# Altium project Luna v2.PrjPcb (part 7 of 7)
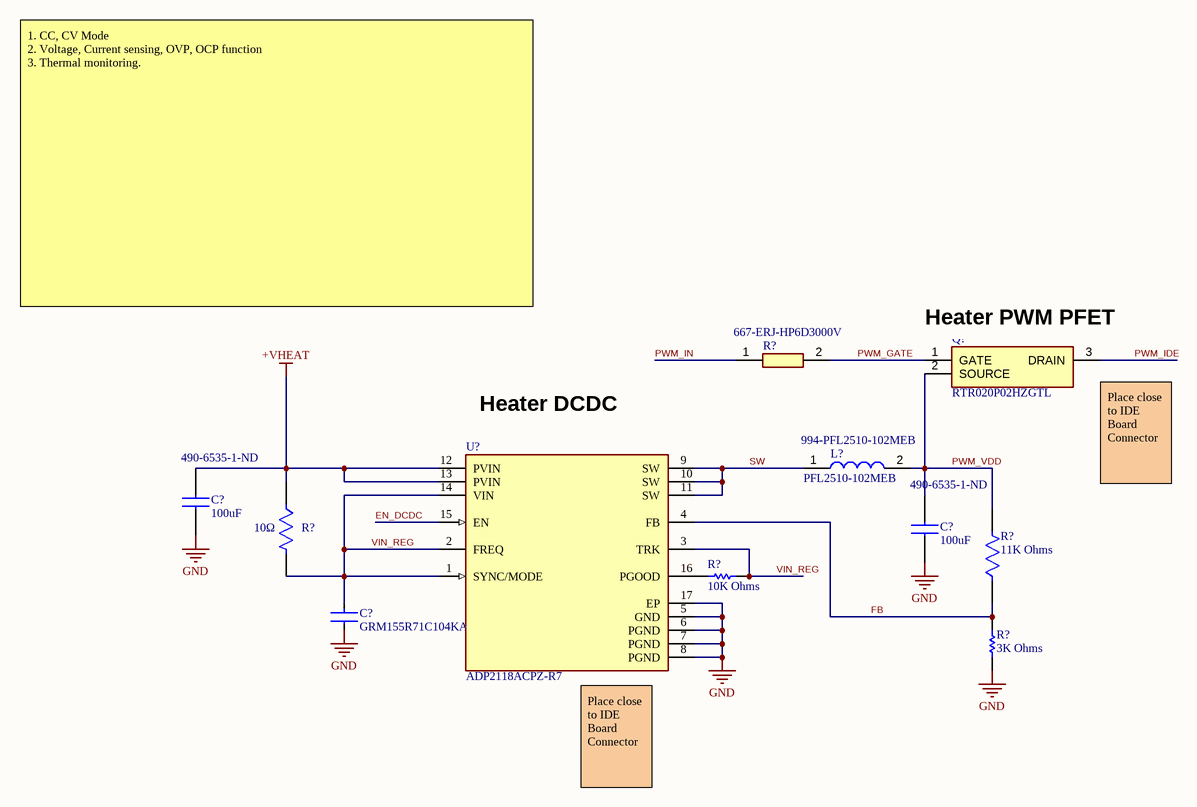
[diagram p28: Heater.SchDoc]

## Nets that join several sheets
+3.3V: Analog Sense (FB?#1.2 FB?#2.2), POWER (C?#19.1 C?#20.2 C?#21.2 U?#4.3)
+VHEAT: POWER (J?#2.6 J?#2.7), Heater (C?#22.1 R?#17.1 U?#5.12 U?#5.13)
DCDC_1V8_OUT: 04 MAIN POWER (R7.2), 05 MIMXRT1170 PART1 (C279.1 FB2.1 R416.2 U5.M6), 06 MIMXRT1170 PART2 (R23.2 R24.2 R373.2 R374.2), 08 B2B (C19.1 C22.1 J6.10), 15 BOOT (13 pins)
DCDC_1V8_OUT_SENSE: 05 MIMXRT1170 PART1 (7 pins), 08 B2B (J6.12)
GND: Analog Sense (36 pins), 04 MAIN POWER (32 pins), 05 MIMXRT1170 PART1 (87 pins), 06 MIMXRT1170 PART2 (17 pins), 07 MIMXRT1170 PART3 (11 pins), 08 B2B (58 pins), 09 Parallel Camera (15 pins), 10 FLASH_BOOT (C81.2 C82.2 U17.4), 11 SDRAM (17 pins), 12 DMIC (7 pins), 13 USB (11 pins), 14 TPU (115 pins), 15 BOOT (16 pins), 16 INTERFACE (15 pins), POWER (9 pins), Heater (9 pins)
MCM_1V8: 06 MIMXRT1170 PART2 (U10.3 U10.7), 07 MIMXRT1170 PART3 (U5.P2), 14 TPU (7 pins)
MCM_3V3: 07 MIMXRT1170 PART3 (C251.1 U5.D16), 08 B2B (J6.6), 14 TPU (29 pins), 16 INTERFACE (R171.2)
MCM_3V3_SENSE: 08 B2B (J6.8), 14 TPU (R22.1 U21.4)
VDD_1V8: 04 MAIN POWER (C23.1 C24.1 C25.1 R3.2), 06 MIMXRT1170 PART2 (26 pins), 07 MIMXRT1170 PART3 (11 pins), 08 B2B (6 pins), 10 FLASH_BOOT (R71.2), 11 SDRAM (FB6.1), 13 USB (U4.1), 16 INTERFACE (5 pins)
VDD_1V8_AON: 04 MAIN POWER (5 pins), 08 B2B (J6.3), 16 INTERFACE (R166.2)
VDD_1V8_CAM: 04 MAIN POWER (C14.1 TP7.1 U1.9), 06 MIMXRT1170 PART2 (U13.3 U13.7), 08 B2B (J6.2), 09 Parallel Camera (C31.1 C79.1 J7.11), 16 INTERFACE (C37.1 R13.2 U3.6)
VDD_1V8_MIC: 04 MAIN POWER (C15.1 TP26.1 U1.11), 08 B2B (J6.4), 12 DMIC (C20.1 C83.1 U19.4)
VDD_1V8_SENSE: 04 MAIN POWER (6 pins), 08 B2B (J6.47)
VDD_2V8_CAM: 04 MAIN POWER (C13.1 TP2.1 U1.2), 08 B2B (J6.1), 09 Parallel Camera (C27.1 C29.1 J7.2), 16 INTERFACE (R168.2)
VDD_3V3: Analog Sense (7 pins), 04 MAIN POWER (6 pins), 05 MIMXRT1170 PART1 (5 pins), 07 MIMXRT1170 PART3 (FB5.1), 08 B2B (5 pins), 14 TPU (U21.1), 16 INTERFACE (J10.3 R169.2 R170.2)
VDD_3V3_SENSE: 04 MAIN POWER (6 pins), 08 B2B (J6.31)
VDD_COIN_3V: 05 MIMXRT1170 PART1 (D3.A), 08 B2B (J5.83), 16 INTERFACE (J10.4)
VDD_LPSR_IN: 05 MIMXRT1170 PART1 (C300.1 R415.2 TP15.1 U5.R12), 08 B2B (J6.13)
VDD_SNVS_ANA: 05 MIMXRT1170 PART1 (6 pins), 16 INTERFACE (R167.2)
VDDA_1P0: 05 MIMXRT1170 PART1 (C276.1 U5.N11), 07 MIMXRT1170 PART3 (R1848.1), 08 B2B (J6.5)
VSYS: 04 MAIN POWER (9 pins), 05 MIMXRT1170 PART1 (C18.1 U2.3 U2.4), 06 MIMXRT1170 PART2 (R40.2), 08 B2B (7 pins), 16 INTERFACE (J9.12)
VUSB: 04 MAIN POWER (R8.2), 07 MIMXRT1170 PART3 (C252.1 U5.D17), 13 USB (8 pins)
ADC1_CH0A: 06 MIMXRT1170 PART2 (U5.N13), 16 INTERFACE (J9.3)
ADC1_CH0B: 06 MIMXRT1170 PART2 (U5.T17), 16 INTERFACE (J9.4)
BOOT_MODE0: 06 MIMXRT1170 PART2 (U5.P6), 15 BOOT (R163.2 SW1.5), 16 INTERFACE (R30.1 R31.2)
BOOT_MODE1: 06 MIMXRT1170 PART2 (U5.T7), 15 BOOT (R164.2 SW1.2), 16 INTERFACE (D6.A Q4.1 R29.1)
BRD_STAT_LED: 05 MIMXRT1170 PART1 (U5.L9), 16 INTERFACE (Q10.1 R172.1)
BT_CFG1_0_ENET_RGMII_TXD3: 06 MIMXRT1170 PART2 (R10.2 U5.D10), 15 BOOT (R139.1 R151.1)
BT_CFG1_1_ENET_RGMII_TXD2: 06 MIMXRT1170 PART2 (R16.2 U5.E12), 15 BOOT (R140.1 R152.1)
BT_CFG1_2_ENET_RGMII_TXD1: 06 MIMXRT1170 PART2 (R18.2 U5.A15), 15 BOOT (R141.1 R153.1)
BT_CFG1_3_ENET_RGMII_TXD0: 06 MIMXRT1170 PART2 (R19.2 U5.C13), 15 BOOT (R142.1 R154.1)
BT_CFG1_4_ENET_RGMII_TX_EN: 06 MIMXRT1170 PART2 (R20.2 U5.B14), 15 BOOT (R143.1 R155.1)
BT_CFG1_5_ENET_RGMII_TXC: 06 MIMXRT1170 PART2 (R26.2 U5.A14), 15 BOOT (R144.1 R156.1)
BT_CFG1_6: 06 MIMXRT1170 PART2 (U5.E8), 15 BOOT (R145.1 R157.1)
BT_CFG1_7: 06 MIMXRT1170 PART2 (U5.F8), 15 BOOT (R146.1 R158.1)
BT_CFG2_0: 06 MIMXRT1170 PART2 (U5.E9), 15 BOOT (R147.1 R159.1)
BT_CFG2_1: 06 MIMXRT1170 PART2 (U5.D7), 15 BOOT (R148.1 R160.1)
BT_CFG2_2: 06 MIMXRT1170 PART2 (U5.C7), 15 BOOT (R149.1 R161.1)
BT_CFG2_3: 06 MIMXRT1170 PART2 (U5.C9), 15 BOOT (R150.1 R162.1)
CA_AFE_MUX_EN: Analog Sense (U?#1.2), 06 MIMXRT1170 PART2 (R24.1 U5.E15)
CA_AFE_MUX_SEL0: Analog Sense (U?#1.1), 06 MIMXRT1170 PART2 (U5.J15)
CA_AFE_MUX_SEL1: Analog Sense (U?#1.16), 06 MIMXRT1170 PART2 (U5.J14)
CA_AFE_MUX_SEL2: Analog Sense (U?#1.15), 06 MIMXRT1170 PART2 (U5.H13)
CAMERA_TRIG: 07 MIMXRT1170 PART3 (U5.T2), 09 Parallel Camera (J7.4)
CSI_DATA02: 06 MIMXRT1170 PART2 (U5.J12), 09 Parallel Camera (J7.17)
CSI_DATA03: 06 MIMXRT1170 PART2 (U5.K12), 09 Parallel Camera (J7.18)
CSI_DATA04: 06 MIMXRT1170 PART2 (U5.K14), 09 Parallel Camera (J7.19)
CSI_DATA05: 06 MIMXRT1170 PART2 (U5.K13), 09 Parallel Camera (J7.20)
CSI_DATA06: 06 MIMXRT1170 PART2 (U5.L16), 09 Parallel Camera (J7.21)
CSI_DATA07: 06 MIMXRT1170 PART2 (U5.M16), 09 Parallel Camera (J7.22)
CSI_DATA08: 06 MIMXRT1170 PART2 (U5.N15), 09 Parallel Camera (J7.23)
CSI_DATA09: 06 MIMXRT1170 PART2 (U5.N17), 09 Parallel Camera (J7.24)
CSI_HSYNC: 06 MIMXRT1170 PART2 (U5.M14), 09 Parallel Camera (J7.6)
CSI_MCLK: 06 MIMXRT1170 PART2 (R44.2), 09 Parallel Camera (J7.14)
CSI_PIXCLK: 06 MIMXRT1170 PART2 (U5.P17), 09 Parallel Camera (J7.16)
CSI_VSYNC: 06 MIMXRT1170 PART2 (U5.N14), 09 Parallel Camera (J7.5), 16 INTERFACE (U3.2)
DA_GPIO0_WDOG_KICK: 04 MAIN POWER (TP27.1 U1.21), 05 MIMXRT1170 PART1 (U5.P10)
DA_nONKEY: 04 MAIN POWER (U1.15), 16 INTERFACE (5 pins)
DAC_OUT: 05 MIMXRT1170 PART1 (D31.K U5.H16), 16 INTERFACE (J10.9)
DMIC_DATA0: 06 MIMXRT1170 PART2 (U5.R6), 12 DMIC (R87.2)
FLEXPWM1_PWM0_A: 06 MIMXRT1170 PART2 (U5.N12), 16 INTERFACE (J9.10)
FLEXPWM1_PWM0_B: 06 MIMXRT1170 PART2 (U5.R14), 16 INTERFACE (J9.9)
FLEXPWM1_PWM1_A: 06 MIMXRT1170 PART2 (U5.R13), 16 INTERFACE (Q3.1)
FlexSPI_A_CLK: 06 MIMXRT1170 PART2 (U5.G14), 10 FLASH_BOOT (R75.1)
FlexSPI_A_D0: 06 MIMXRT1170 PART2 (U5.F15), 10 FLASH_BOOT (R76.1)
FlexSPI_A_D1: 06 MIMXRT1170 PART2 (U5.H15), 10 FLASH_BOOT (R78.1)
FlexSPI_A_D2: 06 MIMXRT1170 PART2 (U5.H14), 10 FLASH_BOOT (R85.1)
FlexSPI_A_D3: 06 MIMXRT1170 PART2 (U5.F16), 10 FLASH_BOOT (R84.1)
FlexSPI_A_SS0: 06 MIMXRT1170 PART2 (U5.F17), 10 FLASH_BOOT (R79.1)
I2C5_SCL: 04 MAIN POWER (U1.14), 06 MIMXRT1170 PART2 (5 pins)
I2C5_SCL_CAM: 06 MIMXRT1170 PART2 (U13.6), 09 Parallel Camera (J7.7)
I2C5_SCL_MCM: 06 MIMXRT1170 PART2 (U10.6), 14 TPU (TP41.1 U23.50)
I2C5_SDA: 04 MAIN POWER (U1.13), 06 MIMXRT1170 PART2 (5 pins)
I2C5_SDA_CAM: 06 MIMXRT1170 PART2 (U13.2), 09 Parallel Camera (J7.8)
I2C5_SDA_MCM: 06 MIMXRT1170 PART2 (U10.2), 14 TPU (TP42.1 U23.49)
I2C6_SCL: 06 MIMXRT1170 PART2 (R51.1 U5.R8), 16 INTERFACE (J9.11)
I2C6_SDA: 06 MIMXRT1170 PART2 (R50.1 U5.P8), 16 INTERFACE (J10.10)
INT_AFE0: Analog Sense (U?#2.F5), 05 MIMXRT1170 PART1 (U5.P9)
LPSPI1_PCS0_AFE: Analog Sense (U?#2.F7), 06 MIMXRT1170 PART2 (U5.M17)
LPSPI1_SCK_AFE: Analog Sense (U?#2.F8), 06 MIMXRT1170 PART2 (U5.L17)
LPSPI1_SDI_AFE: Analog Sense (U?#2.E7), 06 MIMXRT1170 PART2 (U5.J17)
LPSPI1_SDO_AFE: Analog Sense (U?#2.E8), 06 MIMXRT1170 PART2 (U5.K17)
LPSPI6_CS0: 06 MIMXRT1170 PART2 (U5.P5), 16 INTERFACE (J10.5)
LPUART6_CTS_B: 07 MIMXRT1170 PART3 (U5.K2), 16 INTERFACE (J9.7)
LPUART6_RTS_B: 07 MIMXRT1170 PART3 (U5.K4), 16 INTERFACE (J9.8)
LPUART6_RXD: 07 MIMXRT1170 PART3 (TP31.1 U5.L1), 16 INTERFACE (J9.6)
LPUART6_TXD: 07 MIMXRT1170 PART3 (TP30.1 U5.K1), 16 INTERFACE (J9.5)
MCM_SD_ALARM: 07 MIMXRT1170 PART3 (U5.L4), 14 TPU (TP37.1 U23.82)
MIC_CLK: 06 MIMXRT1170 PART2 (U5.N6), 12 DMIC (R86.1)
OTG1_D_N: 07 MIMXRT1170 PART3 (U5.E16), 13 USB (L7.2)
OTG1_D_P: 07 MIMXRT1170 PART3 (U5.E17), 13 USB (L7.3)
PMIC_ON_REQ: 04 MAIN POWER (R6.1), 05 MIMXRT1170 PART1 (R1821.1 TP13.1 U5.U9)
POR_B: 04 MAIN POWER (U1.22), 05 MIMXRT1170 PART1 (C115.1 R215.1 U5.T10), 16 INTERFACE (SW3.1)
PRIVACY_OVERRIDE: 07 MIMXRT1170 PART3 (U5.M2), 16 INTERFACE (R12.2)
SEMC_A0: 07 MIMXRT1170 PART3 (U5.A3), 11 SDRAM (U18.H7)
SEMC_A1: 07 MIMXRT1170 PART3 (U5.A2), 11 SDRAM (U18.H8)
SEMC_A2: 07 MIMXRT1170 PART3 (U5.C2), 11 SDRAM (U18.J8)
SEMC_A3: 07 MIMXRT1170 PART3 (U5.C5), 11 SDRAM (U18.J7)
SEMC_A4: 07 MIMXRT1170 PART3 (U5.D5), 11 SDRAM (U18.J3)
SEMC_A5: 07 MIMXRT1170 PART3 (U5.B1), 11 SDRAM (U18.J2)
SEMC_A6: 07 MIMXRT1170 PART3 (U5.C1), 11 SDRAM (U18.H3)
SEMC_A7: 07 MIMXRT1170 PART3 (U5.D3), 11 SDRAM (U18.H2)
SEMC_A8: 07 MIMXRT1170 PART3 (U5.B3), 11 SDRAM (U18.H1)
SEMC_A9: 07 MIMXRT1170 PART3 (U5.B4), 11 SDRAM (U18.G3)
SEMC_A10: 07 MIMXRT1170 PART3 (U5.B2), 11 SDRAM (U18.H9)
SEMC_A11: 07 MIMXRT1170 PART3 (U5.C4), 11 SDRAM (U18.G2)
SEMC_A12: 07 MIMXRT1170 PART3 (U5.C3), 11 SDRAM (U18.G1)
SEMC_BA0: 07 MIMXRT1170 PART3 (U5.G2), 11 SDRAM (U18.G7)
SEMC_BA1: 07 MIMXRT1170 PART3 (U5.H2), 11 SDRAM (U18.G8)
SEMC_CAS: 07 MIMXRT1170 PART3 (U5.J5), 11 SDRAM (U18.F7)
SEMC_CKE: 07 MIMXRT1170 PART3 (U5.G5), 11 SDRAM (R135.2 U18.F3)
SEMC_CLK: 07 MIMXRT1170 PART3 (U5.J3), 11 SDRAM (R365.1)
SEMC_CS0: 07 MIMXRT1170 PART3 (U5.E6), 11 SDRAM (R90.1 U18.G9)
SEMC_D0: 07 MIMXRT1170 PART3 (U5.F3), 11 SDRAM (U18.A8)
SEMC_D1: 07 MIMXRT1170 PART3 (U5.F2), 11 SDRAM (U18.B9)
SEMC_D2: 07 MIMXRT1170 PART3 (U5.G4), 11 SDRAM (U18.B8)
SEMC_D3: 07 MIMXRT1170 PART3 (U5.E4), 11 SDRAM (U18.C9)
SEMC_D4: 07 MIMXRT1170 PART3 (U5.H5), 11 SDRAM (U18.C8)
SEMC_D5: 07 MIMXRT1170 PART3 (U5.F4), 11 SDRAM (U18.D9)
SEMC_D6: 07 MIMXRT1170 PART3 (U5.H4), 11 SDRAM (U18.D8)
SEMC_D7: 07 MIMXRT1170 PART3 (U5.H3), 11 SDRAM (U18.E9)
SEMC_D8: 07 MIMXRT1170 PART3 (U5.E3), 11 SDRAM (U18.E1)
SEMC_D9: 07 MIMXRT1170 PART3 (U5.D2), 11 SDRAM (U18.D2)
SEMC_D10: 07 MIMXRT1170 PART3 (U5.D1), 11 SDRAM (U18.D1)
SEMC_D11: 07 MIMXRT1170 PART3 (U5.E2), 11 SDRAM (U18.C2)
SEMC_D12: 07 MIMXRT1170 PART3 (U5.E1), 11 SDRAM (U18.C1)
SEMC_D13: 07 MIMXRT1170 PART3 (U5.F1), 11 SDRAM (U18.B2)
SEMC_D14: 07 MIMXRT1170 PART3 (U5.G1), 11 SDRAM (U18.B1)
SEMC_D15: 07 MIMXRT1170 PART3 (U5.H1), 11 SDRAM (U18.A2)
SEMC_DM0: 07 MIMXRT1170 PART3 (U5.F5), 11 SDRAM (U18.E8)
SEMC_DM1: 07 MIMXRT1170 PART3 (U5.J1), 11 SDRAM (U18.F1)
SEMC_RAS: 07 MIMXRT1170 PART3 (U5.J4), 11 SDRAM (U18.F8)
SEMC_WE: 07 MIMXRT1170 PART3 (U5.E5), 11 SDRAM (U18.F9)
SPI6_SCK__JTAG_nTRST: 06 MIMXRT1170 PART2 (TP18.1 U5.R5), 16 INTERFACE (J10.6)
SPI6_SDI__JTAG_TDI: 06 MIMXRT1170 PART2 (TP20.1 U5.U5), 16 INTERFACE (J10.8)
SPI6_SDO__JTAG_TDO: 06 MIMXRT1170 PART2 (TP19.1 U5.T5), 16 INTERFACE (J10.7)
TPU_BOOT_FAIL: 07 MIMXRT1170 PART3 (U5.K5), 14 TPU (U23.85)
TPU_POW_EN: 07 MIMXRT1170 PART3 (U5.L2), 14 TPU (R39.2 U21.3)
TPU_RST_L: 07 MIMXRT1170 PART3 (U5.M4), 14 TPU (R136.2 U23.76)
USB2_TPU_N: 07 MIMXRT1170 PART3 (U5.C16), 14 TPU (R133.1)
USB2_TPU_P: 07 MIMXRT1170 PART3 (U5.C17), 14 TPU (R132.1)
USB_OTG1_ID: 06 MIMXRT1170 PART2 (R43.2), 13 USB (U20.9)
USB_PORT_RT: 06 MIMXRT1170 PART2 (U5.R15), 13 USB (R17.2 U4.2)
USER_BUTTON: 05 MIMXRT1170 PART1 (U5.R10), 16 INTERFACE (D1.A R167.1)
USER_LED: 05 MIMXRT1170 PART1 (U5.M10), 16 INTERFACE (Q2.1)

## Assembly variants
Production: not fitted C39 C40 C41 C43 C44 C46 C109 C110 J9 J10 R15 R21 R25 R37 R53 R73 R74 R90 R116 R125 R135 R139 R140 R141 R142 R143 R144 R147 R148 R150 R157 R158 R161 R163 R164 R164 R189 R397 SW1